# Altium schematic sheet P-MT3620RDB-1-0_PMU.SchDoc: MT3620 RDB PMU
size A3; CompanyName: Microsoft Research; DrawnBy: Stuart Taylor; Revision: 1.0; SheetNumber: 3; SheetTotal: 5; ProjectName: MT3620 Reference Development Board
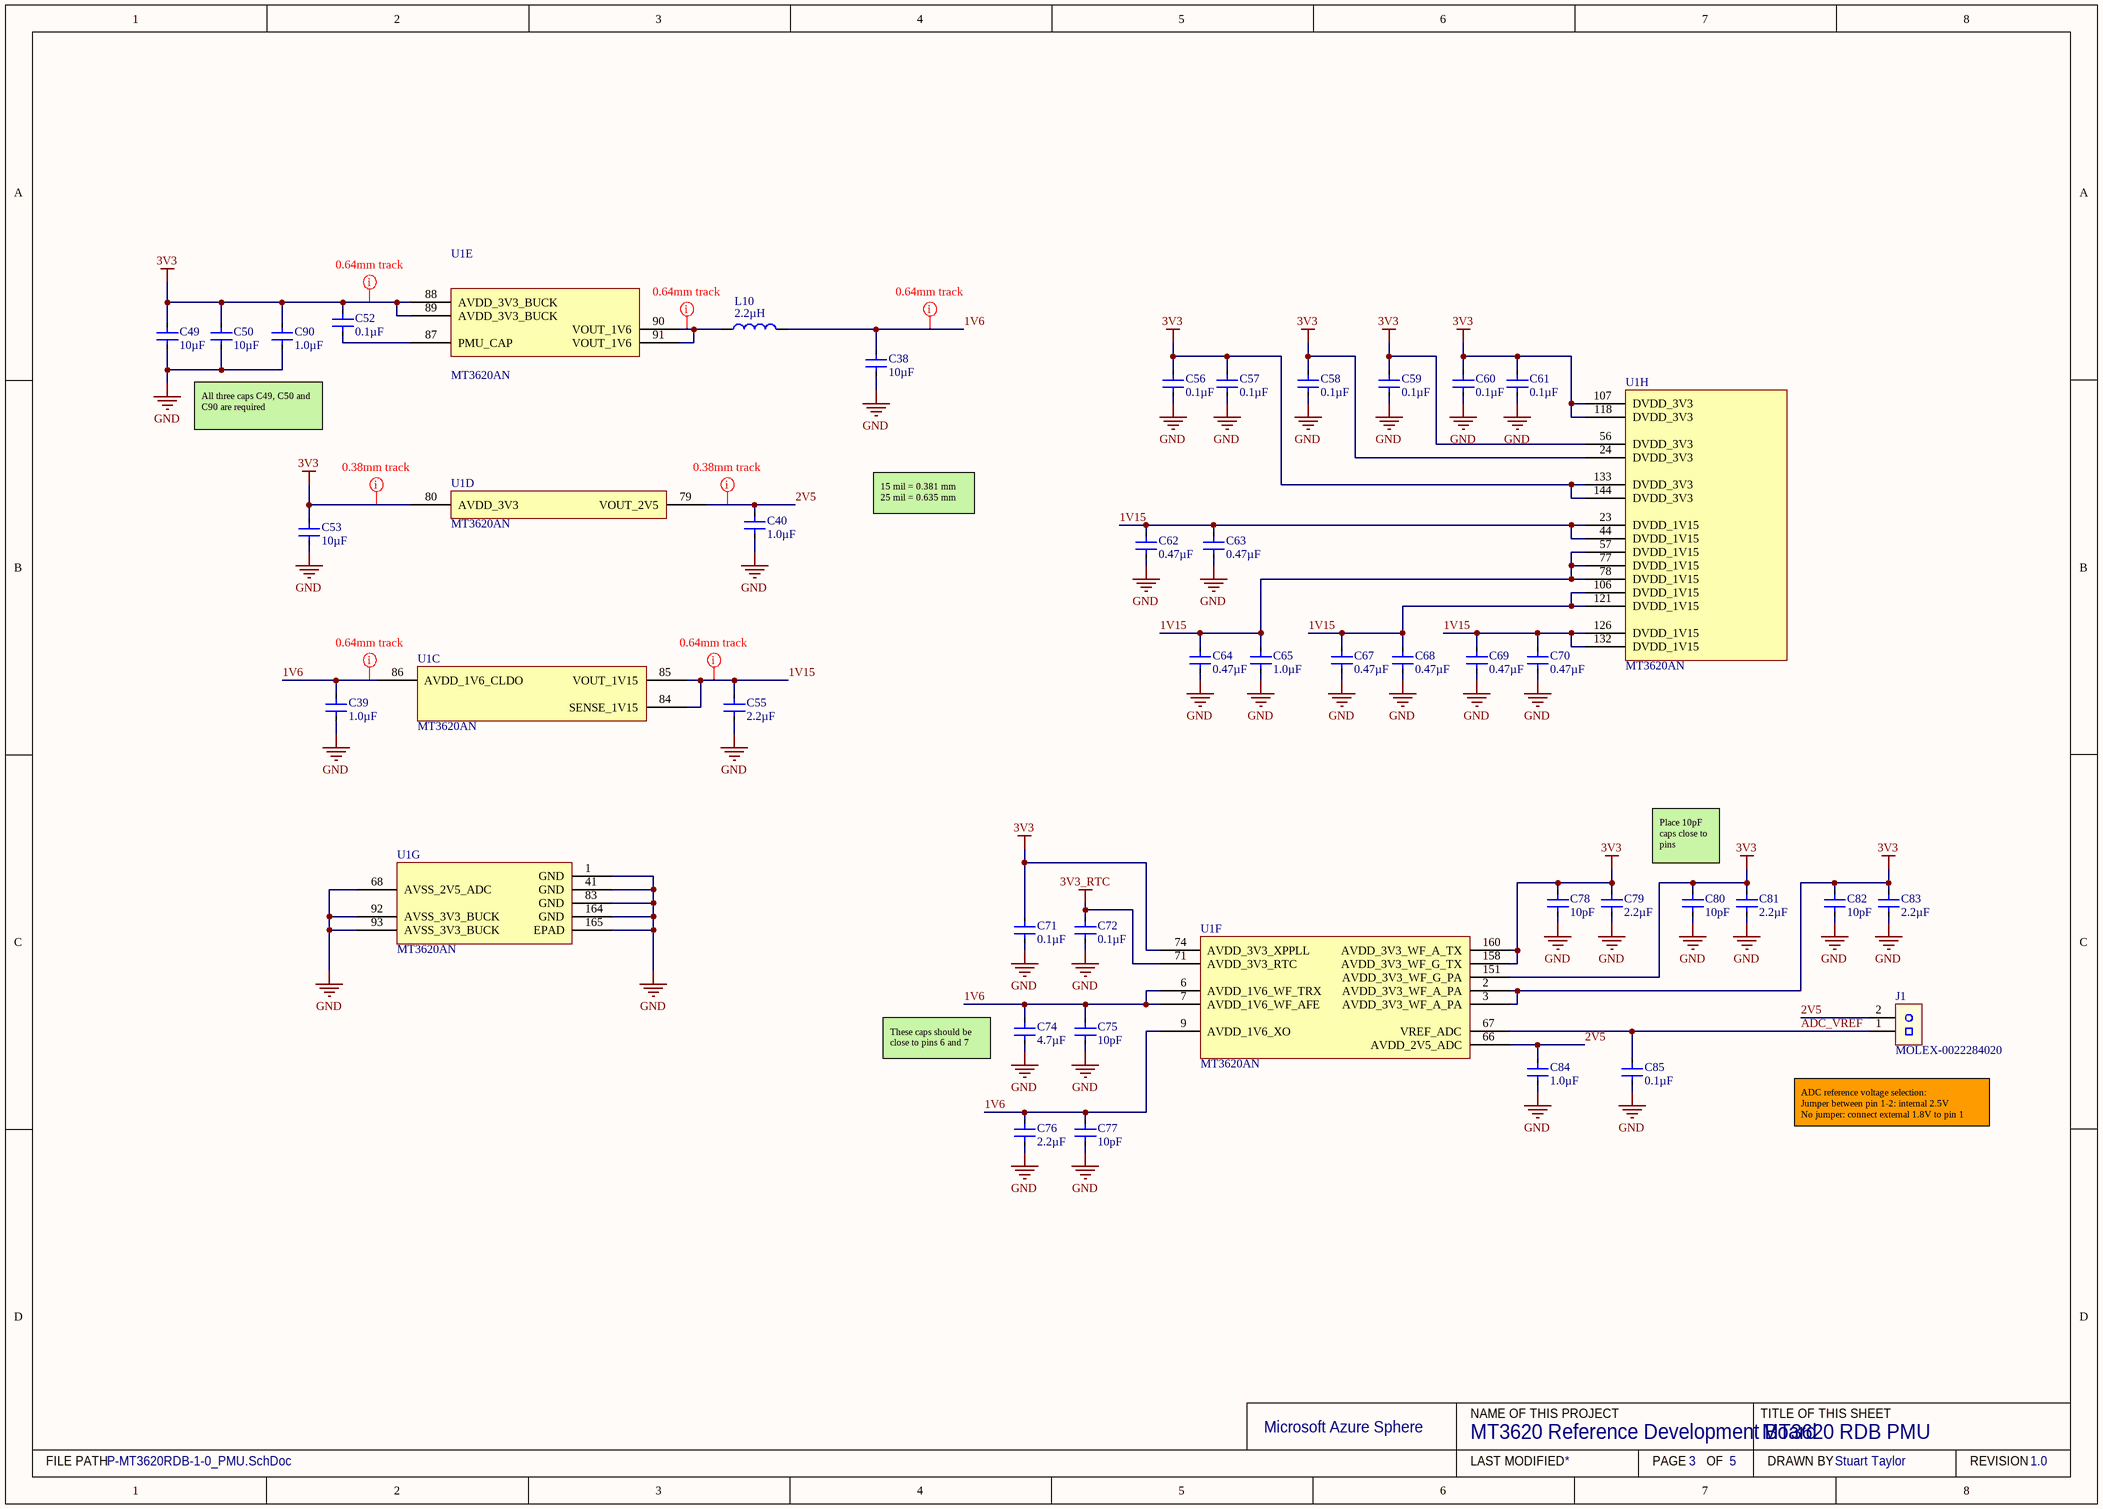
[diagram p0: P-MT3620RDB-1-0_PMU.SchDoc]

## Parts
C38  10µF  [CAPC1608-EIA0603-1MM-MED]
C39  1.0µF  [CAPC1005-EIA0402 0.55MM MED]
C40  1.0µF  [CAPC1005-EIA0402 0.55MM MED]
C49  10µF  [CAPC1005-EIA0402 0.55MM MED]
C50  10µF  [CAPC1005-EIA0402 0.55MM MED]
C52  0.1µF  [CAPC1005-EIA0402 0.55MM MED]
C53  10µF  [CAPC1005-EIA0402 0.55MM MED]
C55  2.2µF  [CAPC1005-EIA0402 0.55MM MED]
C56  0.1µF  [CAPC1005-EIA0402 0.55MM MED]
C57  0.1µF  [CAPC1005-EIA0402 0.55MM MED]
C58  0.1µF  [CAPC1005-EIA0402 0.55MM MED]
C59  0.1µF  [CAPC1005-EIA0402 0.55MM MED]
C60  0.1µF  [CAPC1005-EIA0402 0.55MM MED]
C61  0.1µF  [CAPC1005-EIA0402 0.55MM MED]
C62  0.47µF  [CAPC1005-EIA0402 0.55MM MED]
C63  0.47µF  [CAPC1005-EIA0402 0.55MM MED]
C64  0.47µF  [CAPC1005-EIA0402 0.55MM MED]
C65  1.0µF  [CAPC1005-EIA0402 0.55MM MED]
C67  0.47µF  [CAPC1005-EIA0402 0.55MM MED]
C68  0.47µF  [CAPC1005-EIA0402 0.55MM MED]
C69  0.47µF  [CAPC1005-EIA0402 0.55MM MED]
C70  0.47µF  [CAPC1005-EIA0402 0.55MM MED]
C71  0.1µF  [CAPC1005-EIA0402 0.55MM MED]
C72  0.1µF  [CAPC1005-EIA0402 0.55MM MED]
C74  4.7µF  [CAPC1005-EIA0402 0.55MM MED]
C75  10pF  [CAPC1005-EIA0402 0.55MM MED]
C76  2.2µF  [CAPC1005-EIA0402 0.55MM MED]
C77  10pF  [CAPC1005-EIA0402 0.55MM MED]
C78  10pF  [CAPC1005-EIA0402 0.55MM MED]
C79  2.2µF  [CAPC1005-EIA0402 0.55MM MED]
C80  10pF  [CAPC1005-EIA0402 0.55MM MED]
C81  2.2µF  [CAPC1005-EIA0402 0.55MM MED]
C82  10pF  [CAPC1005-EIA0402 0.55MM MED]
C83  2.2µF  [CAPC1005-EIA0402 0.55MM MED]
C84  1.0µF  [CAPC1005-EIA0402 0.55MM MED]
C85  0.1µF  [CAPC1005-EIA0402 0.55MM MED]
C90  1.0µF  [CAPC1005-EIA0402 0.55MM MED]
J1  MOLEX-0022284020  [0022284020]
L10  2.2µH  [MAMK2520T2R2M]
U1  MT3620AN  [MT3620_MaskSquaresVias50]  (parts C,D,E,F,G,H of 14)

## Nets
3V3: C49.2 C50.2 C52.2 C53.2 C56.2 C57.2 C58.2 C59.2 C60.2 C61.2 C71.2 C78.2 C79.2 C80.2 C81.2 C82.2 C83.2 C90.2 U1.2(AVDD_3V3_WF_A_PA) U1.3(AVDD_3V3_WF_A_PA) U1.24(DVDD_3V3) U1.56(DVDD_3V3) U1.74(AVDD_3V3_XPPLL) U1.80(AVDD_3V3) U1.88(AVDD_3V3_BUCK) U1.89(AVDD_3V3_BUCK) U1.107(DVDD_3V3) U1.118(DVDD_3V3) U1.133(DVDD_3V3) U1.144(DVDD_3V3) U1.151(AVDD_3V3_WF_G_PA) U1.158(AVDD_3V3_WF_G_TX) U1.160(AVDD_3V3_WF_A_TX)
3V3_RTC: C72.2 U1.71(AVDD_3V3_RTC)
GND: C38.1 C39.1 C40.1 C49.1 C50.1 C53.1 C55.1 C56.1 C57.1 C58.1 C59.1 C60.1 C61.1 C62.1 C63.1 C64.1 C65.1 C67.1 C68.1 C69.1 C70.1 C71.1 C72.1 C74.1 C75.1 C76.1 C77.1 C78.1 C79.1 C80.1 C81.1 C82.1 C83.1 C84.1 C85.1 C90.1 U1.1(GND) U1.41(GND) U1.68(AVSS_2V5_ADC) U1.83(GND) U1.92(AVSS_3V3_BUCK) U1.93(AVSS_3V3_BUCK) U1.164(GND) U1.165(EPAD)
1V6: C38.2 C39.2 C74.2 C75.2 C76.2 C77.2 L10.2 U1.6(AVDD_1V6_WF_TRX) U1.7(AVDD_1V6_WF_AFE) U1.9(AVDD_1V6_XO) U1.86(AVDD_1V6_CLDO)
1V15: C55.2 C62.2 C63.2 C64.2 C65.2 C67.2 C68.2 C69.2 C70.2 U1.23(DVDD_1V15) U1.44(DVDD_1V15) U1.57(DVDD_1V15) U1.77(DVDD_1V15) U1.78(DVDD_1V15) U1.84(SENSE_1V15) U1.85(VOUT_1V15) U1.106(DVDD_1V15) U1.121(DVDD_1V15) U1.126(DVDD_1V15) U1.132(DVDD_1V15)
2V5: C40.2 C84.2 J1.2 U1.66(AVDD_2V5_ADC) U1.79(VOUT_2V5)
ADC_VREF: C85.2 J1.1 U1.67(VREF_ADC)
NetC52_1: C52.1 U1.87(PMU_CAP)
NetL10_1: L10.1 U1.90(VOUT_1V6) U1.91(VOUT_1V6)

## Layout directives
rule Undefined: 1V6, 1V15, 2V5, 3V3, NetL10_1

## Notes on the sheet
- All three caps C49, C50 and C90 are required
- 15 mil = 0.381 mm
  25 mil = 0.635 mm
- Place 10pF caps close to pins
- (near C74) These caps should be close to pins 6 and 7
- (near J1) ADC reference voltage selection:
  Jumper between pin 1-2: internal 2.5V
  No jumper: connect external 1.8V to pin 1
- Microsoft Azure Sphere
- NAME OF THIS PROJECT
- TITLE OF THIS SHEET
- FILE PATH
- LAST MODIFIED
- PAGE
- OF
- DRAWN BY
- REVISION

## Library data of the parts
C38 = 10µF 0603 X5R 25V: CAP CER 10UF 25V 20% X5R 0603; Manufacturer: TDK Corporation; Manufacturer Part Number: C1608X5R1E106M080AC; Supplier 1: Digi-Key; RoHS: RoHS Compliant; Category: Capacitors; Stock 1: 47833; Pricing 1: 0.00754; Packaging: Tape & Reel (TR); Tolerance: ±20%; Voltage - Rated: 25V; Temperature Coefficient: X5R; Mounting Type: Surface Mount, MLCC; Operating Temperature: -55°C ~ 125°C; Applications: General Purpose; Package / Case: 0603 (1608 Metric); Size / Dimension: 0.063" L x 0.031" W (1.60mm x 0.80mm); Height - Seated (Max): -; Thickness (Max): 0.039" (1.00mm); Lead Spacing: -; Features: -; Lead Style: -; ComponentLink1URL: http://product.tdk.com/en/catalog/datasheets/mlcc_commercial_general_en.pdf; ComponentLink1Description: http://product.tdk.com/en/catalog/datasheets/mlcc_commercial_general_en.pdf; Supplier Part Number 1: 445-9015-2-ND; Ratings: -; Capacitance: 10µF
C39 C40 C65 C84 C90 = 1.0µF 0402 X5R 35V: CAP CER 1UF 35V 10% X5R 0402; Manufacturer: TDK Corporation; Manufacturer Part Number: C1005X5R1V105K050BC; Supplier 1: Digi-Key; RoHS: RoHS Compliant; Category: Capacitors; Stock 1: 47833; Pricing 1: 0.0186; Packaging: Tape & Reel (TR); Tolerance: ±10%; Voltage - Rated: 35V; Temperature Coefficient: X5R; Mounting Type: Surface Mount, MLCC; Operating Temperature: -55°C ~ 125°C; Applications: General Purpose; Package / Case: 0402 (1005 Metric); Size / Dimension: 0.039" L x 0.020" W (1.00mm x 0.50mm); Height - Seated (Max): -; Thickness (Max): 0.022" (0.55mm); Lead Spacing: -; Features: -; Lead Style: -; ComponentLink1URL: http://product.tdk.com/en/catalog/datasheets/mlcc_commercial_general_en.pdf; ComponentLink1Description: http://product.tdk.com/en/catalog/datasheets/mlcc_commercial_general_en.pdf; Supplier Part Number 1: 445-9073-2-ND; Ratings: -; Capacitance: 1.0µF
C49 C50 C53 = 10µF 0402 X5R 6.3V: CAP CER 10UF 6.3V 20% X5R 0402; Manufacturer: TDK Corporation; Manufacturer Part Number: C1005X5R0J106M050BC; Supplier 1: Digi-Key; RoHS: RoHS Compliant; Category: Capacitors; Stock 1: 47833; Pricing 1: 0.07766; Packaging: Tape & Reel (TR); Tolerance: ±20%; Voltage - Rated: 6.3V; Temperature Coefficient: X5R; Mounting Type: Surface Mount, MLCC; Operating Temperature: -55°C ~ 125°C; Applications: General Purpose; Package / Case: 0402 (1005 Metric); Size / Dimension: 0.039" L x 0.020" W (1.00mm x 0.50mm); Height - Seated (Max): -; Thickness (Max): 0.020" (0.50mm); Lead Spacing: -; Features: -; Lead Style: -; ComponentLink1URL: http://product.tdk.com/en/catalog/datasheets/mlcc_commercial_general_en.pdf; ComponentLink1Description: http://product.tdk.com/en/catalog/datasheets/mlcc_commercial_general_en.pdf; Supplier Part Number 1: 445-8920-2-ND; Ratings: -; Capacitance: 10µF
C52 C56-C61 C71 C72 C85 = 0.1µF 0402 X7R 50V: CAP CER 0.1UF 50V 10% X7R 0402; Manufacturer: TDK Corporation; Manufacturer Part Number: C1005X7R1H104K050BB; Supplier 1: Digi-Key; RoHS: RoHS Compliant; Category: Capacitors; Stock 1: 47833; Pricing 1: 0.01305; Packaging: Tape & Reel (TR); Tolerance: ±10%; Voltage - Rated: 50V; Temperature Coefficient: X7R; Mounting Type: Surface Mount, MLCC; Operating Temperature: -55°C ~ 125°C; Applications: General Purpose; Package / Case: 0402 (1005 Metric); Size / Dimension: 0.039" L x 0.020" W (1.00mm x 0.50mm); Height - Seated (Max): -; Thickness (Max): 0.022" (0.55mm); Lead Spacing: -; Features: -; Lead Style: -; ComponentLink1URL: http://product.tdk.com/en/catalog/datasheets/mlcc_commercial_general_en.pdf; ComponentLink1Description: http://product.tdk.com/en/catalog/datasheets/mlcc_commercial_general_en.pdf; Supplier Part Number 1: 445-5932-2-ND; Ratings: -; Capacitance: 0.1µF
C55 C76 C79 C81 C83 = 2.2µF 0402 X5R 35V: CAP CER 2.2UF 35V 10% X5R 0402; Manufacturer: TDK Corporation; Manufacturer Part Number: C1005X5R1V225K050BC; Supplier 1: Digi-Key; RoHS: RoHS Compliant; Category: Capacitors; Stock 1: 47833; Pricing 1: 0.04177; Packaging: Tape & Reel (TR); Tolerance: ±10%; Voltage - Rated: 35V; Temperature Coefficient: X5R; Mounting Type: Surface Mount, MLCC; Operating Temperature: -55°C ~ 125°C; Applications: General Purpose; Package / Case: 0402 (1005 Metric); Size / Dimension: 0.039" L x 0.020" W (1.00mm x 0.50mm); Height - Seated (Max): -; Thickness (Max): 0.022" (0.55mm); Lead Spacing: -; Features: -; Lead Style: -; ComponentLink1URL: http://product.tdk.com/en/catalog/datasheets/mlcc_commercial_general_en.pdf; ComponentLink1Description: http://product.tdk.com/en/catalog/datasheets/mlcc_commercial_general_en.pdf; Supplier Part Number 1: 445-9028-2-ND; Ratings: -; Capacitance: 2.2µF
C62-C64 C67-C70 = 0.47µF 0402 X5R 35V: CAP CER 0.47UF 35V 10% X5R 0402; Manufacturer: TDK Corporation; Manufacturer Part Number: C1005X5R1V474K050BC; Supplier 1: Digi-Key; RoHS: RoHS Compliant; Category: Capacitors; Stock 1: 47833; Pricing 1: 0.01762; Packaging: Tape & Reel (TR); Tolerance: ±10%; Voltage - Rated: 35V; Temperature Coefficient: X5R; Mounting Type: Surface Mount, MLCC; Operating Temperature: -55°C ~ 125°C; Applications: General Purpose; Package / Case: 0402 (1005 Metric); Size / Dimension: 0.039" L x 0.020" W (1.00mm x 0.50mm); Height - Seated (Max): -; Thickness (Max): 0.022" (0.55mm); Lead Spacing: -; Features: -; Lead Style: -; ComponentLink1URL: http://product.tdk.com/en/catalog/datasheets/mlcc_commercial_general_en.pdf; ComponentLink1Description: http://product.tdk.com/en/catalog/datasheets/mlcc_commercial_general_en.pdf; Supplier Part Number 1: 445-13864-2-ND; Ratings: -; Capacitance: 0.47µF
C74 = 4.7µF 0402 X5R 10V: CAP CER 4.7UF 10V 10% X5R 0402; Manufacturer: TDK Corporation; Manufacturer Part Number: C1005X5R1A475K050BC; Supplier 1: Digi-Key; RoHS: RoHS Compliant; Category: Capacitors; Stock 1: 47833; Pricing 1: 0.06265; Packaging: Tape & Reel (TR); Tolerance: ±10%; Voltage - Rated: 10V; Temperature Coefficient: X5R; Mounting Type: Surface Mount, MLCC; Operating Temperature: -55°C ~ 125°C; Applications: General Purpose; Package / Case: 0402 (1005 Metric); Size / Dimension: 0.039" L x 0.020" W (1.00mm x 0.50mm); Height - Seated (Max): -; Thickness (Max): 0.022" (0.55mm); Lead Spacing: -; Features: -; Lead Style: -; ComponentLink1URL: http://product.tdk.com/en/catalog/datasheets/mlcc_commercial_general_en.pdf; ComponentLink1Description: http://product.tdk.com/en/catalog/datasheets/mlcc_commercial_general_en.pdf; Supplier Part Number 1: 445-13820-2-ND; Ratings: -; Capacitance: 4.7µF
C75 C77 C78 C80 C82 = 10pF 0402 C0G, NP0 50V: CAP CER 10PF 50V NP0 0402; Manufacturer: TDK Corporation; Manufacturer Part Number: C1005C0G1H100D050BA; Tolerance: ±0.5pF; Supplier 1: Digi-Key; RoHS: RoHS Compliant; Category: Capacitors; Stock 1: 47833; Pricing 1: 0.00274; Packaging: Tape & Reel (TR); Voltage - Rated: 50V; Temperature Coefficient: C0G, NP0; Mounting Type: Surface Mount, MLCC; Operating Temperature: -55°C ~ 125°C; Applications: General Purpose; Package / Case: 0402 (1005 Metric); Size / Dimension: 0.039" L x 0.020" W (1.00mm x 0.50mm); Height - Seated (Max): -; Thickness (Max): 0.022" (0.55mm); Lead Spacing: -; Features: -; Lead Style: -; ComponentLink1URL: http://product.tdk.com/en/catalog/datasheets/mlcc_commercial_general_en.pdf; ComponentLink1Description: http://product.tdk.com/en/catalog/datasheets/mlcc_commercial_general_en.pdf; Supplier Part Number 1: 445-1235-2-ND; Ratings: -; Capacitance: 10pF
J1 = MOLEX-0022284020: CONN HEADER 2POS .100 VERT TIN; Manufacturer: Molex, LLC; Connector Type: Header, Unshrouded, Breakaway; Number of Positions: 2; Number of Positions Loaded: All; Pitch: 0.100" (2.54mm); Supplier 1: Digi-Key; Manufacturer Part Number: 0022284020; RoHS: RoHS Compliant; Category: Connectors, Interconnects; Stock 1: 10077; Pricing 1: 1=0.12, 10=0.108, 25=0.0808, 50=0.0692, 100=0.0668, 250=0.0576, 500=0.0553 (GBP); Packaging: Bulk; Contact Type: Male Pin; Number of Rows: 1; Row Spacing: -; Contact Mating Length: 0.240" (6.10mm); Mounting Type: Through Hole; Termination: Solder; Fastening Type: -; Features: -; Contact Finish: Tin; Contact Finish Thickness: 100µin (2.54µm); Color: Black; ComponentLink1URL: http://www.molex.com/pdm_docs/sd/022284020_sd.pdf; ComponentLink1Description: http://www.molex.com/pdm_docs/sd/022284020_sd.pdf; Supplier Part Number 1: WM50014-02-ND
L10 = MAMK2520T2R2M: FIXED IND 2.2UH 1.9A 117 MOHM; Manufacturer: Taiyo Yuden; Type: Wirewound; Material - Core: Metal; Tolerance: ±20%; Current - Saturation: 2A; Shielding: Shielded; DC Resistance (DCR): 117 mOhm Max; Frequency - Test: 2MHz; Supplier 1: Digi-Key; Manufacturer Part Number: MAMK2520T2R2M; RoHS: RoHS Compliant; Category: Inductors, Coils, Chokes; Stock 1: 7120; Pricing 1: 1=0.34, 10=0.306, 25=0.2864, 50=0.2482, 100=0.2291, 250=0.21768, 500=0.19858, 1000=0.16803 (GBP); Packaging: Cut Tape (CT); Inductance: 2.2µH; Current Rating: 1.9A; Q @ Freq: -; Frequency - Self Resonant: -; Ratings: -; Operating Temperature: -40°C ~ 105°C; Mounting Type: Surface Mount; Package / Case: 1008 (2520 Metric); Size / Dimension: 0.098" L x 0.079" W (2.50mm x 2.00mm); Height - Seated (Max): 0.047" (1.20mm); ComponentLink1URL: http://ds.yuden.co.jp/TYCOMPAS/ut/detail.do?productNo=MAMK2520T2R2M&fileName=MAMK2520T2R2M_SS&mode=specSheetDownload; ComponentLink1Description: http://ds.yuden.co.jp/TYCOMPAS/ut/detail.do?productNo=MAMK2520T2R2M&fileName=MAMK2520T2R2M_SS&mode=specSheetDownload; Supplier Part Number 1: 587-3226-1-ND
U1 = MT3620AN: Manufacturer: MediaTek Inc.; Manufacturer Part Number: MT3620AN; Supplier Part Number 1: MT3620AN; Supplier 1: MediaTek Inc.